# EAGLE design Shield (EAGLE 7.2.0)
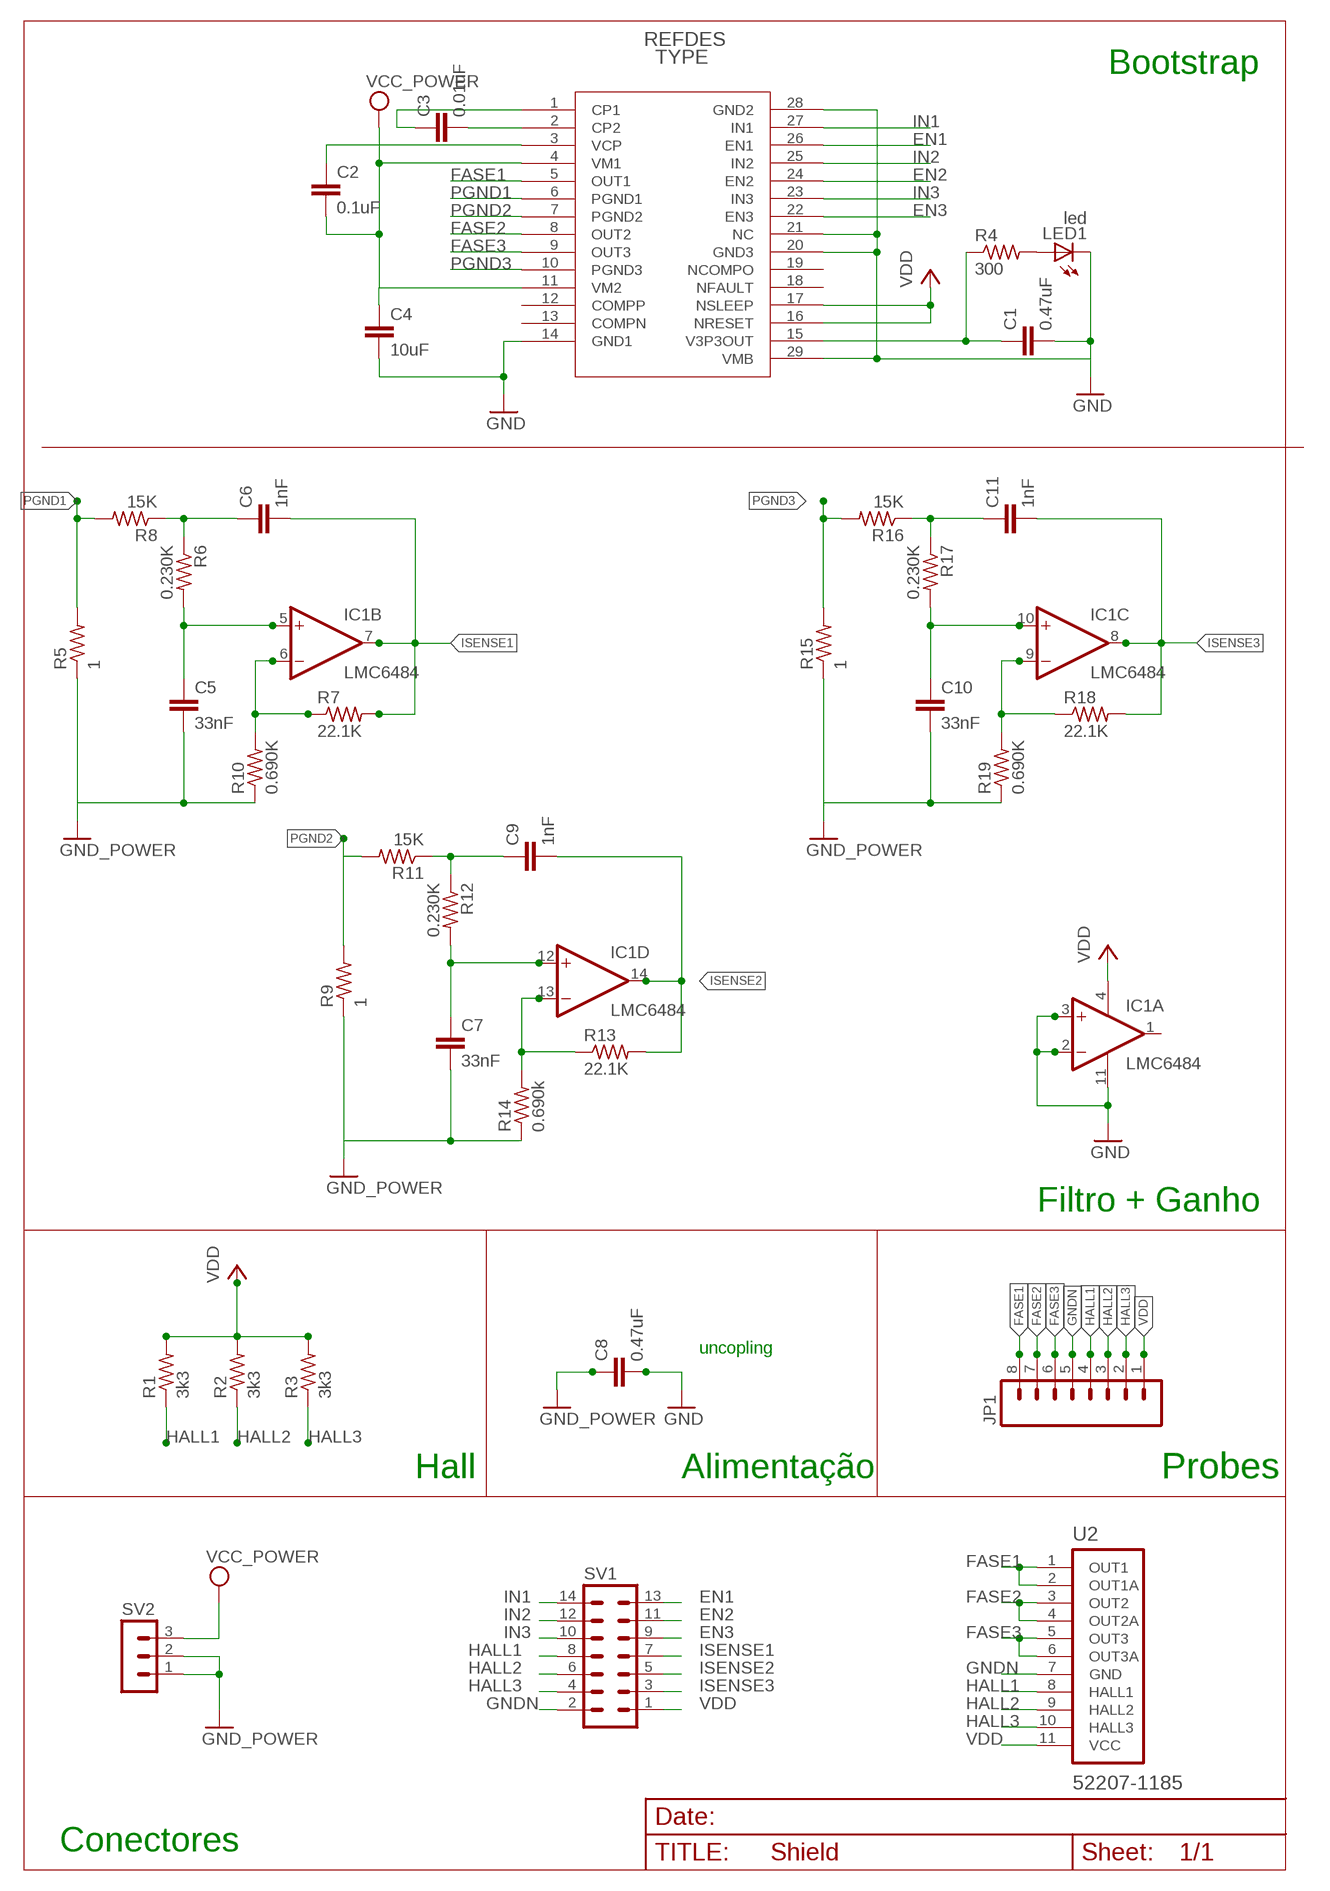
[diagram p0: schematic, sheet 1]

## Parts
C1  0.47uF  C-EUC1206  [C1206]
C2  0.1uF  C-EUC1206  [C1206]
C3  0.01uF  C-EUC1206  [C1206]
C4  10uF  C-EUC1206  [C1206]
C5  33nF  C-EUC1206  [C1206]
C6  1nF  C-EUC1206  [C1206]
C7  33nF  C-EUC1206  [C1206]
C8  0.47uF  C-EUC1206  [C1206]
C9  1nF  C-EUC1206  [C1206]
C10  33nF  C-EUC1206  [C1206]
C11  1nF  C-EUC1206  [C1206]
IC1  LMC6484  [SO14]
JP1  M08  [1X08_ROUND]
LED1  led  LEDCHIPLED_1206  [CHIPLED_1206]
R1  3k3  R-US_R1206  [R1206]
R2  3k3  R-US_R1206  [R1206]
R3  3k3  R-US_R1206  [R1206]
R4  300  R-US_R1206  [R1206]
R5  1  R-US_R2512  [R2512]
R6  0.230K  R-US_R1206  [R1206]
R7  22.1K  R-US_R1206  [R1206]
R8  15K  R-US_R1206  [R1206]
R9  1  R-US_R2512  [R2512]
R10  0.690K  R-US_R1206  [R1206]
R11  15K  R-US_R1206  [R1206]
R12  0.230K  R-US_R1206  [R1206]
R13  22.1K  R-US_R1206  [R1206]
R14  0.690k  R-US_R1206  [R1206]
R15  1  R-US_R2512  [R2512]
R16  15K  R-US_R1206  [R1206]
R17  0.230K  R-US_R1206  [R1206]
R18  22.1K  R-US_R1206  [R1206]
R19  0.690K  R-US_R1206  [R1206]
SV1  MA07-2  [MA07-2]
SV2  MA03-1  [MA03-1]
U1  DRV8811_PWP_28  [PWP28_5P18X3P1]
U2  52207-1185  [MOLEX_52207-1185]

## Nets
EN1: SV1.13 U1.26(EN1)
EN2: SV1.11 U1.24(EN2)
EN3: SV1.9 U1.22(EN3)
FASE1: JP1.8 U1.5(OUT1) U2.1(OUT1) U2.2(OUT1A)
FASE2: JP1.7 U1.8(OUT2) U2.3(OUT2) U2.4(OUT2A)
FASE3: JP1.6 U1.9(OUT3) U2.5(OUT3) U2.6(OUT3A)
GND: C5.2 C7.2 C10.2 IC1.2(A:-IN) IC1.3(A:+IN) IC1.11(P:V-) R5.1 R9.1 R10.1 R14.1 R15.1 R19.1 ; supply symbol labelled GND_POWER
GND_POWER: C8.1
GNDN: C1.2 C4.2 C8.2 JP1.5 LED1.C SV1.2 SV2.1 SV2.2 U1.14(GND1) U1.20(GND3) U1.21(NC) U1.28(GND2) U1.29(VMB) U2.7(GND) ; supply symbol labelled GND, GND_POWER
HALL1: JP1.4 R1.1 SV1.8 U2.8(HALL1)
HALL2: JP1.3 R2.1 SV1.6 U2.9(HALL2)
HALL3: JP1.2 R3.1 SV1.4 U2.10(HALL3)
IN1: SV1.14 U1.27(IN1)
IN2: SV1.12 U1.25(IN2)
IN3: SV1.10 U1.23(IN3)
ISENSE1: C6.2 IC1.7(B:OUT) R7.2 SV1.7
ISENSE2: C9.2 IC1.14(D:OUT) R13.2 SV1.5
ISENSE3: C11.2 IC1.8(C:OUT) R18.2 SV1.3
N$1: C2.1 U1.3(VCP)
N$2: C5.1 IC1.5(B:+IN) R6.2
N$3: IC1.6(B:-IN) R7.1 R10.2
N$4: C6.1 R6.1 R8.1
N$5: C9.1 R11.1 R12.1
N$6: C7.1 IC1.12(D:+IN) R12.2
N$7: IC1.13(D:-IN) R13.1 R14.2
N$8: C11.1 R16.1 R17.1
N$9: C10.1 IC1.10(C:+IN) R17.2
N$10: LED1.A R4.2
N$11: C1.1 R4.1 U1.15(V3P3OUT)
N$12: IC1.9(C:-IN) R18.1 R19.2
N$13: C3.2 U1.2(CP2)
N$14: C3.1 U1.1(CP1)
PGND1: R5.2 R8.2 U1.6(PGND1)
PGND2: R9.2 R11.2 U1.7(PGND2)
PGND3: R15.2 R16.2 U1.10(PGND3)
VCC_POWER: C2.2 C4.1 SV2.3 U1.4(VM1) U1.11(VM2)
VDD: IC1.4(P:V+) JP1.1 R1.2 R2.2 R3.2 SV1.1 U1.16(NRESET) U1.17(NSLEEP) U2.11(VCC)
Unconnected: IC1.1(A:OUT) U1.12(COMPP) U1.13(COMPN) U1.18(NFAULT) U1.19(NCOMPO)

## Notes on the sheet
- Bootstrap
- Filtro + Ganho
- uncopling
- Hall | Alimentação | Probes
- Conectores

## Library data of the parts
C1-C11 = rcl:C-EU: CAPACITOR, European symbol
IC1 = lmc6484:LMC6484: Quad General Purpose, Low Voltage, Rail-to-Rail Output Operational Amplifiers Source: http://www.national.com/mpf/LM/LMV321.html http://www.national.com/dt/lmv_qual.pdf
JP1 = SparkFun-Connectors:M08: Header 8 Standard 8-pin 0.1" header. Use with straight break away headers (SKU : PRT-00116), right angle break away headers (PRT-00553), swiss pins (PRT-00743), machine pins (PRT-00117), and female headers (PRT-00115).
LED1 = adafruit:LED: LED OSRAM: - CHIPLED LG R971, LG N971, LY N971, LG Q971, LY Q971, LO R971, LY R971 LH N974, LH R974 LS Q976, LO Q976, LY Q976 LO Q996 - Hyper CHIPLED LW Q18S LB Q993, LB Q99A, LB R99A - SideLED LS A670, LO A670, LY A670, LG A670, LP A670 LB A673, LV A673, LT A673, LW A673 LH A674 LY A675 LS A676, LA A676, LO A676, LY A676, LW A676 LS A679, LY A679, LG A679 - Hyper Micro SIDELED® LS Y876, LA Y876, LO Y876, LY Y876 LT Y87S - SmartLED LW L88C, LW L88S LB L89C, LB L89S, LG L890 LS L89K, LO L89K, LY L89K LS L896, LA L896, LO L896, LY L896 - TOPLED LS T670, LO T670, LY T670, LG T670, LP T670 LSG T670, LSP T670, LSY T670, LOP T670, LYG T670 LG T671, LOG T671, LSG T671 LB T673, LV T673, LT T673, LW T673 LH T674 LS T676, LA T676, LO T676, LY T676, LB T676, LH T676, LSB T676, LW T676 LB T67C, LV T67C, LT T67C, LS T67K, LO T67K, LY T67K, LW E67C LS E67B, LA E67B, LO E67B, LY E67B, LB E67C, LV E67C, LT E67C LW T67C LS T679, LY T679, LG T679 LS T770, LO T770, LY T770, LG T770, LP T770 LB T773, LV T773, LT T773, LW T773 LH T774 LS E675, LA E675, LY E675, LS T675 LS T776, LA T776, LO T776, LY T776, LB T776 LHGB T686 LT T68C, LB T68C - Hyper Mini TOPLED® LB M676 - Mini TOPLED Santana® LG M470 LS M47K, LO M47K, LY M47K Source: http://www.osram.convergy.de/
R1-R19 = adafruit:R-US_: RESISTOR, American symbol
SV1 = con-lstb:MA07-2: PIN HEADER; OC_FARNELL: unknown; OC_NEWARK: unknown
SV2 = con-lstb:MA03-1: PIN HEADER; OC_FARNELL: unknown; OC_NEWARK: unknown
U1 = drv8313_correto:DRV8811_PWP_28
U2 = rc13:52207-1185: SOCKET FPC, SMT, 1MM, 10 WAY; MPN: 52207-1085; OC_FARNELL: 1079938; OC_NEWARK: 58J9503; PACKAGE: SOCKET FPC, SMT, 1MM, 10 WAY; SUPPLIER: Molex

## Board
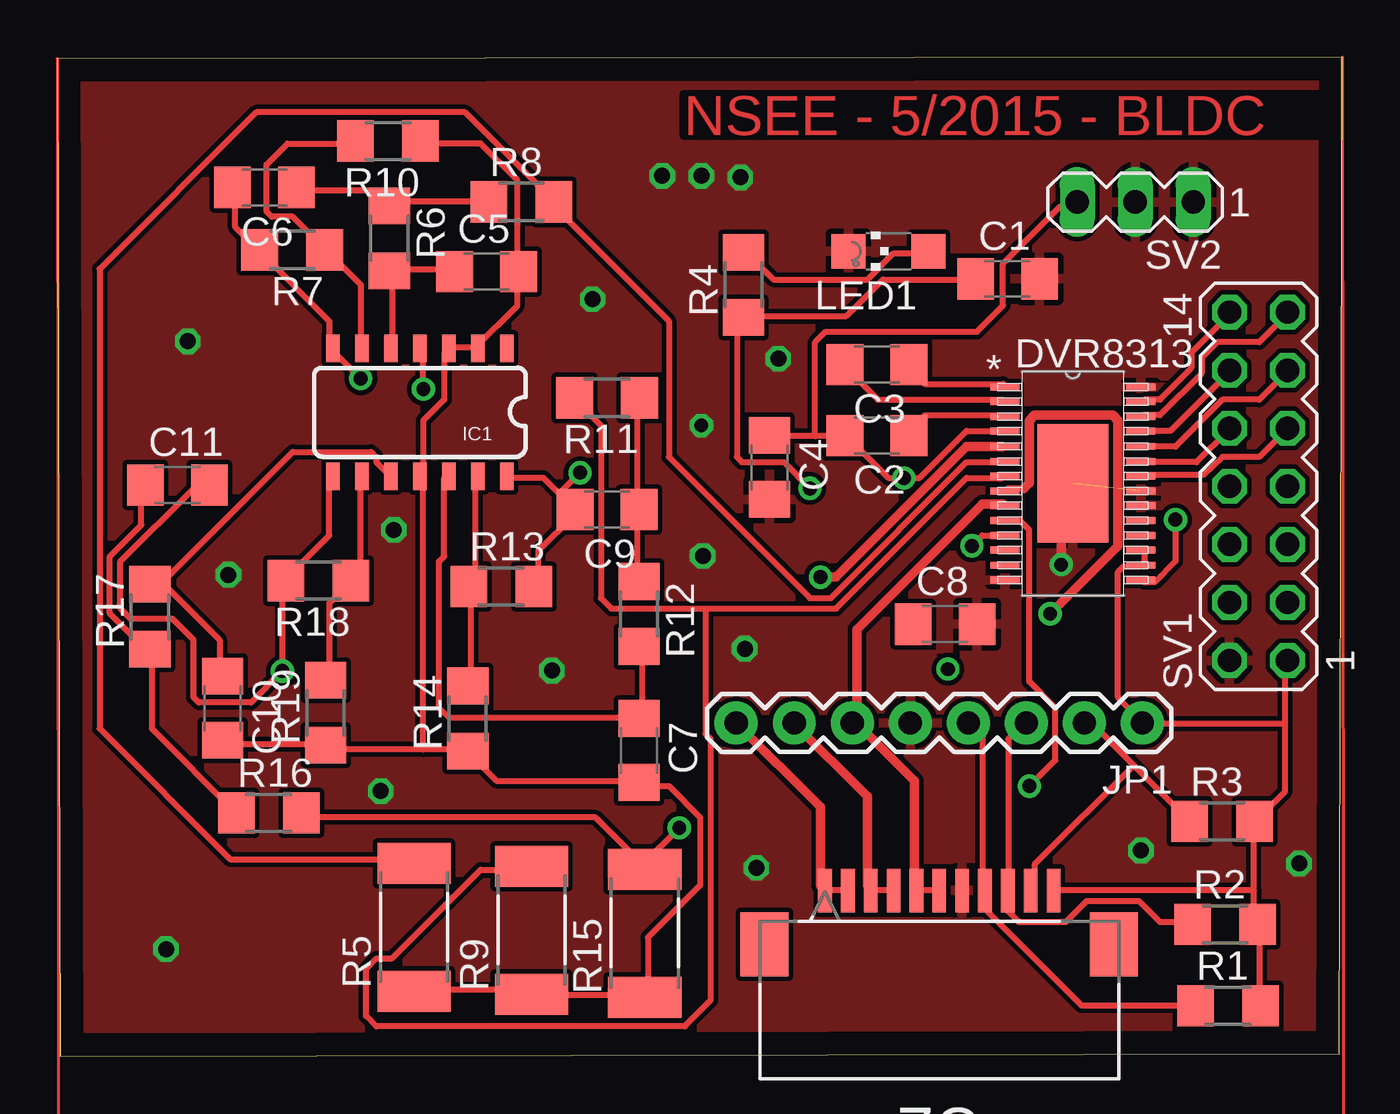
[diagram p1: board, top side]
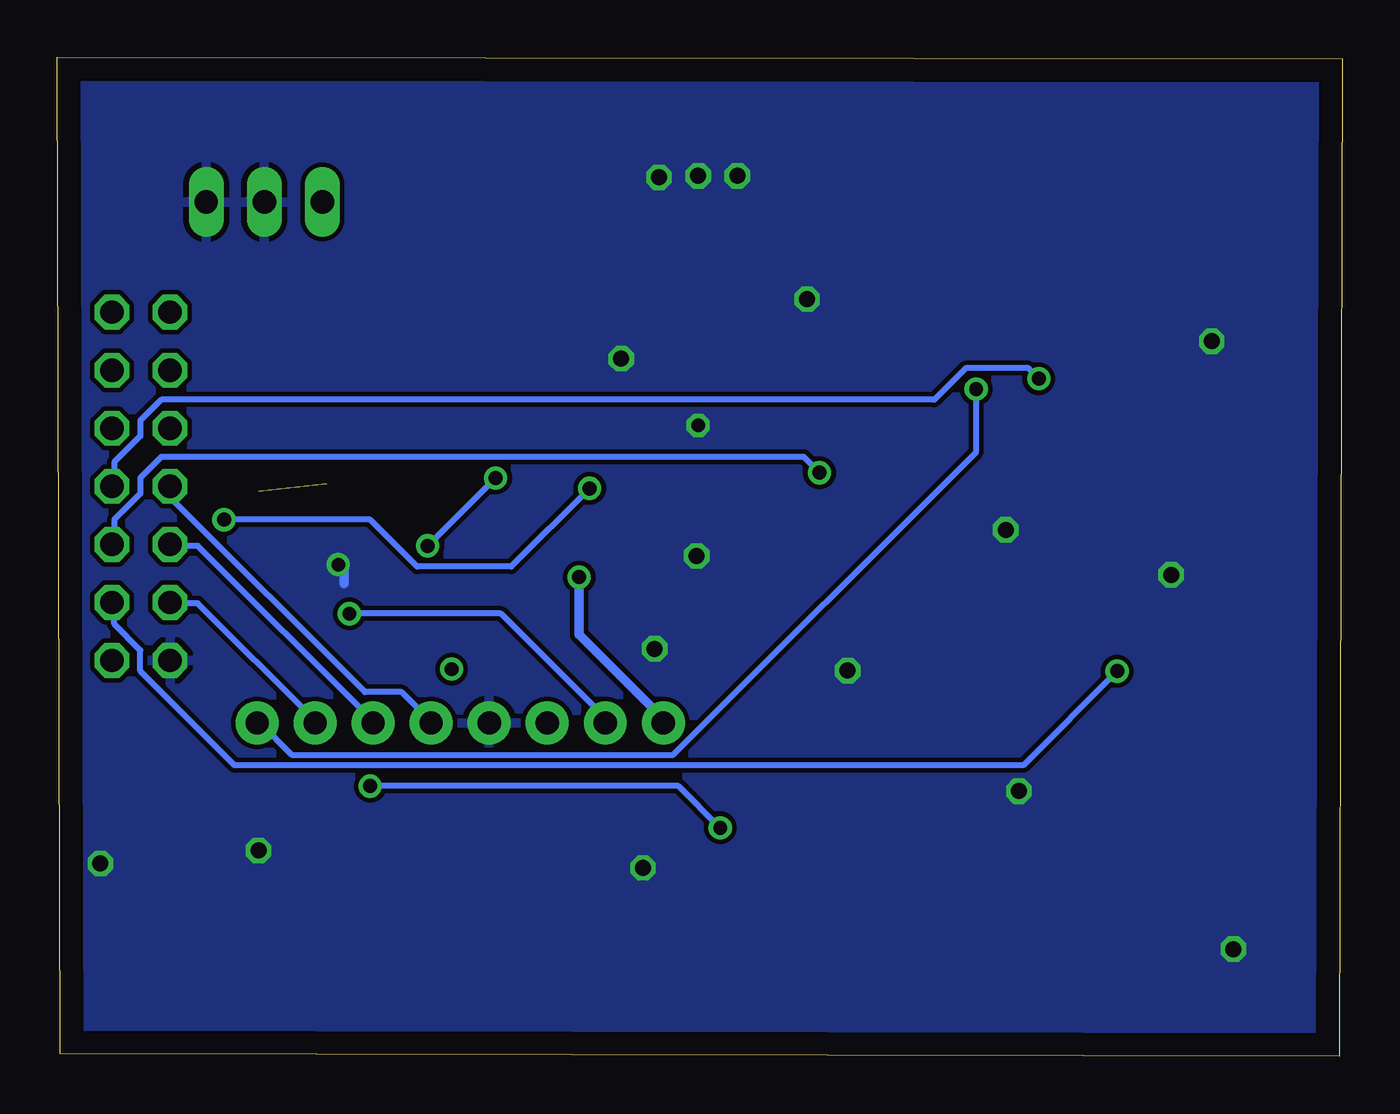
[diagram p2: board, bottom side, seen from below]

Size 56.25 x 43.74 mm. Coordinates in mm from the lower left corner, seen from the top.
Outline: 0.13,0 56.12,0.13 56.25,43.74 0,43.68 0.13,0
Copper layers (1*16): Top 0.035mm / dielectric 1.5mm / Bottom 0.035mm
Design rules "default *": minimum track width 10mil, minimum drill 24mil, track to track 8mil, track to pad 8mil, pad to pad 8mil, via to via 8mil, smd to smd 8mil, copper to edge 40mil, drill to drill 8mil, minimum pad ring 10mil, minimum via ring 8mil, stop-mask expansion 4mil, vias tented up to drill 0mil, thermal gap 10mil

### Footprints (pad centres in the part's own frame; a part is rotated, then mirrored left to right if it is on the bottom)
C1206 = smd 1.6 x 1.8: 1 -1.4,0; 2 1.4,0
SO14 = smd 0.6 x 1.2: 1 -3.81,-2.8; 2 -2.54,-2.8; 3 -1.27,-2.8; 4 0,-2.8; 5 1.27,-2.8; 6 2.54,-2.8; 7 3.81,-2.8; 8 3.81,2.8; 9 2.54,2.8; 10 1.27,2.8; 11 0,2.8; 12 -1.27,2.8; 13 -2.54,2.8; 14 -3.81,2.8
1X08_ROUND = drill 1.016 pad 1.88: 1 0,0; 2 2.54,0; 3 5.08,0; 4 7.62,0; 5 10.16,0; 6 12.7,0; 7 15.24,0; 8 17.78,0
CHIPLED_1206 = smd 1.5 x 1.5: A 0,-1.75; C 0,1.75
R1206 = smd 1.6 x 1.803: 1 -1.422,0; 2 1.422,0
R2512 = smd 1.8 x 3.2: 1 -2.8,0; 2 2.8,0
MA07-2 = drill 1.016 octagon: 1 -7.62,-1.27; 2 -7.62,1.27; 3 -5.08,-1.27; 4 -5.08,1.27; 5 -2.54,-1.27; 6 -2.54,1.27; 7 0,-1.27; 8 0,1.27; 9 2.54,-1.27; 10 2.54,1.27; 11 5.08,-1.27; 12 5.08,1.27; 13 7.62,-1.27; 14 7.62,1.27
MA03-1 = drill 1.016 long: 1 -2.54,0; 2 0,0; 3 2.54,0
PWP28_5P18X3P1 = smd 1.27 x 0.305: 1 -2.972,4.216; 2 -2.972,3.581; 3 -2.972,2.921; 4 -2.972,2.286; 5 -2.972,1.626; 6 -2.972,0.965; 7 -2.972,0.33; 8 -2.972,-0.33; 9 -2.972,-0.965; 10 -2.972,-1.626; 11 -2.972,-2.286; 12 -2.972,-2.921; 13 -2.972,-3.581; 14 -2.972,-4.216; 15 2.972,-4.216; 16 2.972,-3.581; 17 2.972,-2.921; 18 2.972,-2.286; 19 2.972,-1.626; 20 2.972,-0.965; 21 2.972,-0.33; 22 2.972,0.33; 23 2.972,0.965; 24 2.972,1.626; 25 2.972,2.286; 26 2.972,2.921; 27 2.972,3.581; 28 2.972,4.216 | smd 3.099 x 5.182: 29 0,0
MOLEX_52207-1185 = smd 0.6 x 1.9: 1 5,4.8; 2 4,4.8; 3 3,4.8; 4 2,4.8; 5 1,4.8; 6 0,4.8; 7 -1,4.8; 8 -2,4.8; 9 -3,4.8; 10 -4,4.8; 11 -5,4.8 | smd 2.1 x 2.8: 12 -7.65,7.15 | smd 2.108 x 2.794: 13 7.65,7.15

### Placement (x,y rotation side)
C1  41.59,34.04 0 top
C2  35.88,27.18 180 top
C3  35.88,30.29 180 top
C4  31.18,25.78 270 top
C5  18.8,34.35 0 top
C6  9.08,38.04 180 top
C7  25.46,13.4 270 top
C8  38.86,18.92 0 top
C9  24.07,23.94 180 top
C10  7.24,15.24 270 top
C11  5.27,25.02 0 top
IC1  15.88,28.19 180 top
JP1  47.5,14.61 180 top
LED1  36.39,35.24 90 top
R1  51.24,2.22 0 top
R2  51.12,5.78 0 top
R3  50.99,10.29 0 top
R4  30.04,33.78 90 top
R5  15.62,5.65 90 top
R6  14.54,35.81 270 top
R7  10.29,35.31 180 top
R8  20.32,37.4 0 top
R9  20.76,5.52 90 top
R10  0.232K  [R1206]  14.48,40.07 180 top
R11  24.07,28.83 180 top
R12  25.46,19.37 270 top
R13  19.43,20.57 0 top
R14  0.232K  [R1206]  17.97,14.8 90 top
R15  25.72,5.4 90 top
R16  9.27,10.67 0 top
R17  4.06,19.24 90 top
R18  11.43,20.83 180 top
R19  0.232K  [R1206]  11.75,15.05 90 top
SV1  52.58,24.96 90 top
SV2  47.18,37.4 180 top
U1  44.45,25.08 0 top
U2  38.61,12.06 180 top

### Tracks (layer width: path | path; a pad name or v marks a point on that pad's centre or on a via)
EN1
  Top 0.254: U1.26 47.57,28.07 48.26,28.07 50.09,29.9 50.09,30.58 50.77,31.27 52.6,31.27 53.75,32.41 SV1.13
EN2
  Top 0.254: U1.24 47.57,26.7 48.95,26.7 51,28.75 52.6,28.75 53.75,29.9 SV1.11
EN3
  Top 0.254: U1.22 47.64,25.45 50.15,25.45 51,26.24 52.6,26.24 53.75,27.38 SV1.9
FASE1  (via drill 0.61)
  Top 0.254: U2.2 34.54,7.26 33.63,7.26 U2.1 33.4,7.49 | 41.4,26.7 U1.5
  Top 0.406: 41.4,26.7 39.8,26.7 34.09,20.98 v33.4,20.98 | 33.4,7.49 33.4,10.92 JP1.8
  Bottom 0.254: 29.74,14.81 JP1.8
  Bottom 0.406: v33.4,20.98 33.4,18.47 29.74,14.81
FASE2  (via drill 0.61)
  Top 0.254: U2.4 35.69,7.26 U2.3 35.46,7.49 | 42.32,24.87 41.63,24.87 U1.8 | 32.26,14.58 JP1.7
  Top 0.406: 42.32,24.87 42.55,25.1 42.55,27.84 42.77,28.07 46.2,28.07 46.43,27.84 46.43,22.35 v43.46,19.38 | 35.46,7.49 35.46,11.38 32.26,14.58
  Bottom 0.254: v43.46,19.38 36.83,19.38 32.26,14.81 JP1.7
FASE3
  Top 0.254: U2.6 38.43,7.26 37.74,7.26 U2.5 37.52,7.49 | 41.4,24.18 U1.9 | 35,14.81 JP1.6 35,14.58
  Top 0.406: 41.4,24.18 40.49,24.18 35,18.69 35,14.81 | 37.52,7.49 37.52,12.06 35,14.58
GND
  Top 0.254: 18.31,31.04 17.17,31.04 IC1.3 16.94,30.81 16.94,28.75 16.03,27.84 16.03,25.55 IC1.11 16.03,25.32 16.03,13.44 | 18.31,31.04 20.14,32.87 20.14,34.24 C5.2 20.14,34.47 20.14,38.35 18.54,39.95 16.03,39.95 R10.1 | 18.31,31.04 IC1.2 | R5.1 15.8,2.92 20.6,2.92 R9.1 20.83,2.69 25.63,2.69 R15.1 25.86,2.69 25.86,5.21 28.14,7.49 28.14,10.46 26.77,11.84 25.63,11.84 C7.2 25.4,12.06 19.23,12.06 18.09,13.21 R14.1 17.86,13.44 16.03,13.44 | C10.2 7.34,13.66 11.68,13.66 R19.1 11.91,13.44 16.03,13.44
GNDN  (via drill 0.6, 0.7)  (1 unrouted)
  Top 0.406: U1.29 43.94,25.08 v43.94,21.53
  Bottom 0.406: v43.94,21.53 43.69,21.53 43.69,20.7
  other vias: 4.76,4.7 5.71,31.31 28.26,21.91 14.16,11.62 7.49,21.08 30.61,8.26 30.1,17.84 26.48,38.54 28.19,38.54 29.91,38.48 23.43,33.15 14.73,23.05 47.43,9.02 54.36,8.45 21.65,16.89 31.56,30.54 28.19,27.62
  pour Top: -13.59,43.37 -13.59,-4.89 59.37,-4.89 59.37,43.94 -13.59,43.43
  pour Bottom: -12.89,-2.98 58.42,-2.98 58.42,42.93 -12.89,42.54
HALL1
  Top 0.254: R1.1 49.63,2.24 44.83,2.24 40.72,6.35 40.72,7.26 U2.8 40.49,7.49 40.49,14.12 40.03,14.58 JP1.4
  Bottom 0.254: SV1.8 51.23,24.87 51.23,24.41 42.77,15.95 41.17,15.95 40.03,14.81 JP1.4
HALL2
  Top 0.254: R2.1 49.63,5.89 48.26,5.89 47.35,6.81 45.06,6.81 44.14,5.89 42.09,5.89 41.63,6.35 41.63,7.26 U2.9 41.63,7.49 41.63,13.89 42.32,14.58 JP1.3
  Bottom 0.254: SV1.6 51.23,22.35 50.09,22.35 42.55,14.81 JP1.3
HALL3
  Top 0.254: 47.12,12.75 45.06,14.81 JP1.2 | 47.12,12.75 49.4,10.46 R3.1 | 47.12,12.75 42.77,8.41 42.77,7.49 U2.10
  Bottom 0.254: SV1.4 51.23,19.84 50.09,19.84 45.06,14.81 JP1.2
IN1
  Top 0.254: U1.27 47.57,28.75 48.26,28.75 49.63,30.12 49.63,30.81 51.23,32.41 SV1.14
IN2
  Top 0.254: U1.25 47.57,27.38 48.72,27.38 51.23,29.9 SV1.12
IN3
  Top 0.254: U1.23 47.57,26.01 49.86,26.01 51.23,27.38 SV1.10
ISENSE1  (via drill 0.61)
  Top 0.254: C6.2 7.8,37.9 7.8,36.3 8.71,35.38 R7.2 8.94,35.15 11.91,32.18 11.91,31.04 IC1.7 12.14,30.81 v13.28,29.67
  Bottom 0.254: v13.28,29.67 13.74,30.12 16.48,30.12 17.86,28.75 51.69,28.75 52.6,27.84 52.6,27.15 53.75,26.01 53.75,25.1 SV1.7
ISENSE2  (via drill 0.61)
  Top 0.254: 21.97,24.64 22.66,23.95 C9.2 | 21.97,24.64 21.29,25.32 19.68,25.32 IC1.14 | R13.2 21.06,20.75 21.06,22.12 22.66,23.72 C9.2 | 21.97,24.64 v22.89,25.55 | 21.97,24.64 C9.2
  Bottom 0.254: v22.89,25.55 23.57,26.24 51.69,26.24 52.6,25.32 52.6,24.64 53.75,23.5 53.75,22.58 SV1.5
ISENSE3  (via drill 0.61)
  Top 0.254: IC1.8 11.91,25.32 11.91,22.81 10.08,20.98 R18.2 9.86,20.75 v9.86,16.87 8.48,15.49 6.2,15.49 5.97,15.72 5.97,18.24 5.05,19.15 3.23,19.15 2.77,19.61 2.77,21.67 5.97,24.87 6.66,24.87 C11.2
  Bottom 0.254: v9.86,16.87 13.97,12.75 48.49,12.75 52.6,16.87 52.6,17.78 53.75,18.92 53.75,19.84 SV1.3
N$1
  Top 0.254: U1.3 41.4,28.07 37.97,28.07 37.29,27.38 C2.1
N$2
  Top 0.254: IC1.5 14.66,31.04 14.66,34.24 R6.2 14.66,34.47 17.17,34.47 C5.1
N$3
  Top 0.254: IC1.6 13.28,31.04 13.28,33.78 11.91,35.15 R7.1 11.68,35.38 10.31,36.75 9.4,36.75 9.17,36.98 9.17,39.04 10.08,39.95 13.06,39.95 R10.2
N$4
  Top 0.254: C6.1 10.54,37.9 13.97,37.9 14.43,37.44 R6.1 14.66,37.44 18.77,37.44 R8.1
N$5
  Top 0.254: R12.1 25.4,20.98 25.4,23.72 C9.1 25.4,23.95 25.4,28.75 R11.1
N$6
  Top 0.254: IC1.12 16.94,25.32 16.94,21.9 16.71,21.67 16.71,15.27 17.17,14.81 25.4,14.81 C7.1 25.63,14.81 25.63,17.78 R12.2
N$7
  Top 0.254: IC1.13 18.31,25.32 18.31,20.98 18.09,20.75 R13.1 18.09,20.52 18.09,16.41 R14.2
N$8
  Top 0.254: C11.1 3.68,24.87 3.68,23.27 2.31,21.9 2.31,19.38 3.91,17.78 R17.1 4.14,17.78 4.14,14.35 7.8,10.69 R16.1
N$9
  Top 0.254: 4.6,20.75 10.31,26.47 13.74,26.47 13.97,26.24 13.97,26.01 14.43,25.55 IC1.10 | 4.6,20.75 4.14,20.75 R17.2 4.6,20.75 | 4.6,20.75 7.11,18.24 7.11,16.87 C10.1
N$10
  Top 0.254: LED1.A 37.97,35.15 36.6,35.15 35.46,34.01 31.34,34.01 30.2,35.15 R4.2
N$11  (via drill 0.61)
  Top 0.254: v48.95,23.5 48.95,21.67 48.03,20.75 47.57,20.75 U1.15 | v32.94,24.87 31.8,26.01 29.97,26.01 29.74,26.24 29.74,31.95 29.97,32.18 R4.1 30.2,32.41 34.54,32.41 36.14,34.01 40.03,34.01 C1.1
  Bottom 0.254: v48.95,23.5 42.55,23.5 40.49,21.44 36.37,21.44 v32.94,24.87
N$12
  Top 0.254: IC1.9 13.28,25.32 13.28,21.21 13.06,20.98 R18.1 12.83,20.75 11.91,19.84 11.91,16.64 R19.2
N$13
  Top 0.254: U1.2 41.4,28.75 35.92,28.75 34.54,30.12 C3.2
N$14
  Top 0.254: U1.1 41.4,29.44 37.97,29.44 37.29,30.12 C3.1
N$15  (via drill 0.6)
  other vias: 38.99,16.95
PGND1
  Top 0.254: U1.6 41.4,26.01 39.8,26.01 33.86,20.07 32.94,20.07 26.77,26.24 26.77,32.18 21.74,37.21 R8.2 21.74,37.44 17.86,41.33 8.71,41.33 1.85,34.47 1.85,14.35 7.57,8.64 15.57,8.64 R5.2
PGND2
  Top 0.254: 28.37,19.61 24.26,19.61 23.8,20.07 23.8,27.61 22.66,28.75 R11.2 | 28.37,19.61 34.09,19.61 39.8,25.32 41.4,25.32 U1.7 | 28.37,19.61 28.37,14.12 28.6,13.89 28.6,2.46 27.46,1.32 13.97,1.32 13.51,1.78 13.51,3.83 13.97,4.29 14.66,4.29 18.54,8.18 20.6,8.18 R9.2
PGND3  (via drill 0.61)
  Top 0.254: v42.55,11.84 43.69,12.98 43.69,15.27 42.55,16.41 42.55,23.04 42.09,23.5 41.63,23.5 U1.10 | 25.63,8.41 v27.23,10.01 | 25.63,8.41 23.57,10.46 10.77,10.46 R16.2 | 25.63,8.41 R15.2
  Bottom 0.254: v42.55,11.84 29.06,11.84 v27.23,10.01
VCC_POWER  (via drill 0.61)
  Top 0.254: v40.03,22.35 40.49,22.81 41.4,22.81 U1.11 | U1.4 41.4,27.38 39.8,27.38 37.74,25.32 v37.06,25.32 36.37,25.32 34.54,27.15 C2.2 34.31,27.15 33.17,27.15 | 33.17,27.15 31.34,27.15 C4.1 | 33.17,27.15 33.17,31.27 33.63,31.73 40.26,31.73 41.4,32.87 41.4,34.7 43.92,37.21 44.6,37.21 SV2.3
  Bottom 0.254: v37.06,25.32 v40.03,22.35
VDD  (via drill 0.61)
  Top 0.254: R1.2 52.6,2.24 52.6,5.66 R2.2 52.38,5.89 52.38,7.26 | 52.38,7.26 52.38,10.24 R3.2 52.6,10.46 53.75,11.61 53.75,14.58 | 52.38,7.26 43.69,7.26 U2.11 | 53.75,14.58 53.75,17.32 SV1.1 | U1.17 47.57,22.12 47.57,21.44 U1.16 47.35,21.44 46.66,21.44 46.43,21.21 46.43,15.72 47.35,14.81 JP1.1 47.57,14.58 53.75,14.58 | v16.03,29.21 16.03,30.81 IC1.4
  Bottom 0.254: v16.03,29.21 16.03,26.47 29.29,13.21 45.97,13.21 47.35,14.58 JP1.1
(copper drawn outside any net)
  shapes: Top area x1

### Text on the board
Top: NSEE - 5/2015 - BLDC